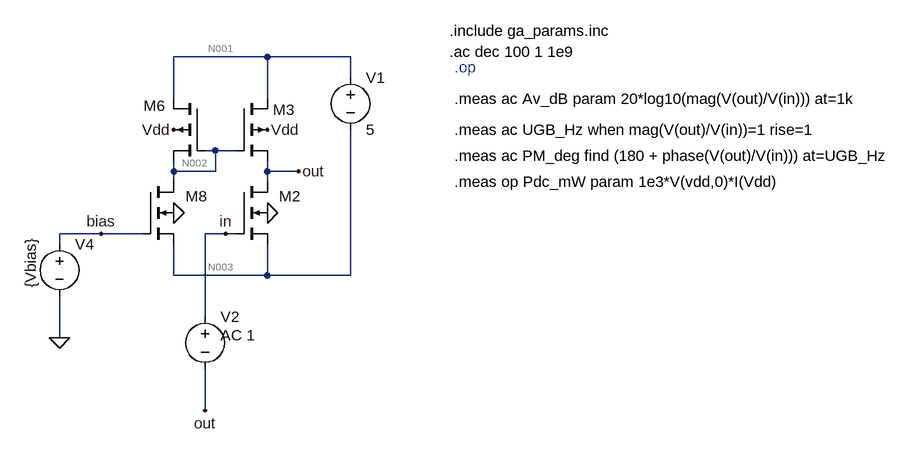
[diagram p0: schematic CMOS class AB Output STAGES.asc]
CMOS class AB Output STAGES.asc, the LTspice schematic file:
Version 4
SHEET 1 1260 960
WIRE -208 -48 -352 -48
WIRE -80 -48 -208 -48
WIRE -80 -16 -80 -48
WIRE -352 16 -352 -48
WIRE -208 16 -208 -48
WIRE -288 96 -304 96
WIRE -256 96 -288 96
WIRE -352 128 -352 112
WIRE -288 128 -288 96
WIRE -288 128 -352 128
WIRE -208 128 -208 112
WIRE -160 128 -208 128
WIRE -352 144 -352 128
WIRE -208 144 -208 128
WIRE -464 224 -528 224
WIRE -400 224 -464 224
WIRE -272 224 -304 224
WIRE -256 224 -272 224
WIRE -528 240 -528 224
WIRE -352 288 -352 240
WIRE -208 288 -208 240
WIRE -208 288 -352 288
WIRE -80 288 -80 64
WIRE -80 288 -208 288
WIRE -304 352 -304 224
WIRE -528 384 -528 320
WIRE -304 496 -304 432
FLAG -528 384 0
FLAG -208 64 Vdd
FLAG -352 64 Vdd
FLAG -352 192 0
FLAG -208 192 0
FLAG -160 128 out
FLAG -464 224 bias
FLAG -272 224 in
FLAG -304 496 out
SYMBOL nmos4 -400 144 R0
WINDOW 0 66 22 Left 2
WINDOW 3 56 72 Invisible 2
SYMATTR InstName M8
SYMATTR Value2 l=0.6u w=5u
SYMBOL pmos4 -304 16 M0
WINDOW 0 61 11 Left 2
WINDOW 3 56 72 Invisible 2
SYMATTR InstName M6
SYMATTR Value2 l=0.6u w=10u
SYMBOL voltage -528 224 R0
WINDOW 123 0 0 Left 0
WINDOW 39 0 0 Left 0
WINDOW 3 -44 7 VRight 2
SYMATTR Value {Vbias}
SYMATTR InstName V4
SYMBOL pmos4 -256 16 R0
WINDOW 0 57 17 Left 2
WINDOW 3 56 72 Invisible 2
SYMATTR InstName M3
SYMATTR Value2 l=0.6u w=10u
SYMBOL voltage -80 -32 R0
WINDOW 123 0 0 Left 0
WINDOW 39 0 0 Left 0
SYMATTR InstName V1
SYMATTR Value 5
SYMBOL nmos4 -256 144 R0
WINDOW 0 66 22 Left 2
WINDOW 3 56 72 Invisible 2
SYMATTR InstName M2
SYMATTR Value2 l=0.6u w=5u
SYMBOL voltage -304 336 R0
WINDOW 123 24 44 Left 2
WINDOW 39 0 0 Left 0
WINDOW 3 24 44 Left 2
SYMATTR Value2 AC 1
SYMATTR Value ""
SYMATTR InstName V2
TEXT 72 -88 Left 2 !.include ga_params.inc
TEXT 72 -56 Left 2 !.ac dec 100 1 1e9
TEXT 80 -32 Left 2 ;.op
TEXT 80 16 Left 2 !.meas ac Av_dB param 20*log10(mag(V(out)/V(in))) at=1k
TEXT 80 64 Left 2 !.meas ac UGB_Hz when mag(V(out)/V(in))=1 rise=1
TEXT 80 104 Left 2 !.meas ac PM_deg find (180 + phase(V(out)/V(in))) at=UGB_Hz
TEXT 80 144 Left 2 !.meas op Pdc_mW param 1e3*V(vdd,0)*I(Vdd)

The netlist it stands for:
* CMOS class AB Output STAGES.asc
M8 N002 bias N003 0 NMOS l=0.6u w=5u
M6 N001 N002 N002 Vdd PMOS l=0.6u w=10u
V4 bias 0 {Vbias}
M3 N001 N002 out Vdd PMOS l=0.6u w=10u
V1 N001 N003 5
M2 out in N003 0 NMOS l=0.6u w=5u
V2 in out AC 1
.model NMOS NMOS
.model PMOS PMOS
.lib standard.mos
.include ga_params.inc
.ac dec 100 1 1e9
* .op
.meas ac Av_dB param 20*log10(mag(V(out)/V(in))) at=1k
.meas ac UGB_Hz when mag(V(out)/V(in))=1 rise=1
.meas ac PM_deg find (180 + phase(V(out)/V(in))) at=UGB_Hz
.meas op Pdc_mW param 1e3*V(vdd,0)*I(Vdd)
.backanno
.end

* Results of the author's LTspice run, read from the files saved beside the schematic
* Operating Point, zero values left out:
*   V(n002) = 4.73 V
*   V(n003) = -158.4 mV
*   V(n001) = 4.842 V
*   V(vdd) = 4.684 V
*   V(out) = 719.3 nV
*   V(in) = 719.3 nV
*   Id(M8) = 2.09 µA
*   Is(M8) = -2.09 µA
*   Id(M2) = 2.09 µA
*   Ib(M2) = 4.712 pA
*   Is(M2) = -2.09 µA
*   Id(M6) = 2.09 µA
*   Ib(M6) = -4.736 pA
*   Is(M6) = -2.09 µA
*   Id(M3) = 2.09 µA
*   Is(M3) = -2.09 µA
*   I(V1) = -4.181 µA